# EAGLE design FAE_V2_1 (EAGLE 9.0.1)
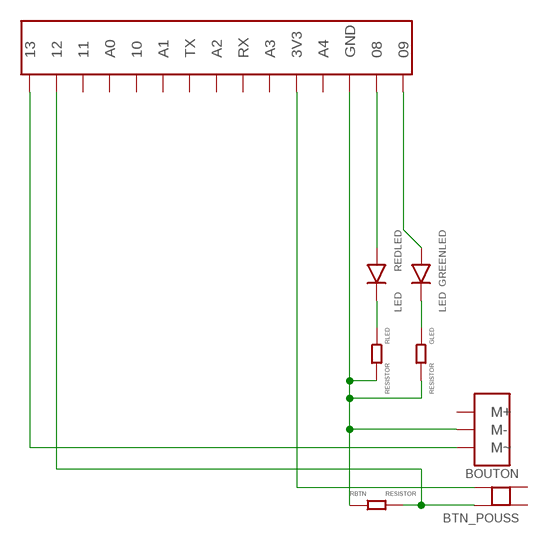
[diagram p0: schematic, sheet 1]

## Parts
BTN_POUSS  BOUTON  [BOUTON]
GLED  RESISTOR  [RESISTOR]
GREENLED  LED  [LED]
RBTN  RESISTOR  [RESISTOR]
REDLED  LED  [LED]
RLED  RESISTOR  [RESISTOR]
U$1  RAZOR_BOARD  [RAZOR_BOARD]
U$3  SERVO_ADAPT  [SERVO_ADAPT]

## Nets
N$1: GREENLED.IN U$1.09
N$2: GLED.A GREENLED.OUT
N$4: BTN_POUSS.D U$1.3V3
N$5: BTN_POUSS.C RBTN.B U$1.12
N$6: U$1.13 U$3.M~
N$10: GLED.B RBTN.A RLED.B U$1.GND U$3.M-
N$11: REDLED.IN U$1.08
N$12: REDLED.OUT RLED.A
Unconnected: BTN_POUSS.A BTN_POUSS.B U$1.10 U$1.11 U$1.A0 U$1.A1 U$1.A2 U$1.A3 U$1.A4 U$1.RX U$1.TX U$3.M+

## Library data of the parts
BTN_POUSS = FAE:BOUTON
GLED RBTN RLED = FAE:RESISTOR
GREENLED REDLED = FAE:LED
U$1 = FAE:RAZOR_BOARD
U$3 = FAE:SERVO_ADAPT

## Net classes
0 default: width 0.5 mm, drill 0.3 mm, clearance 0.7 mm

## Board
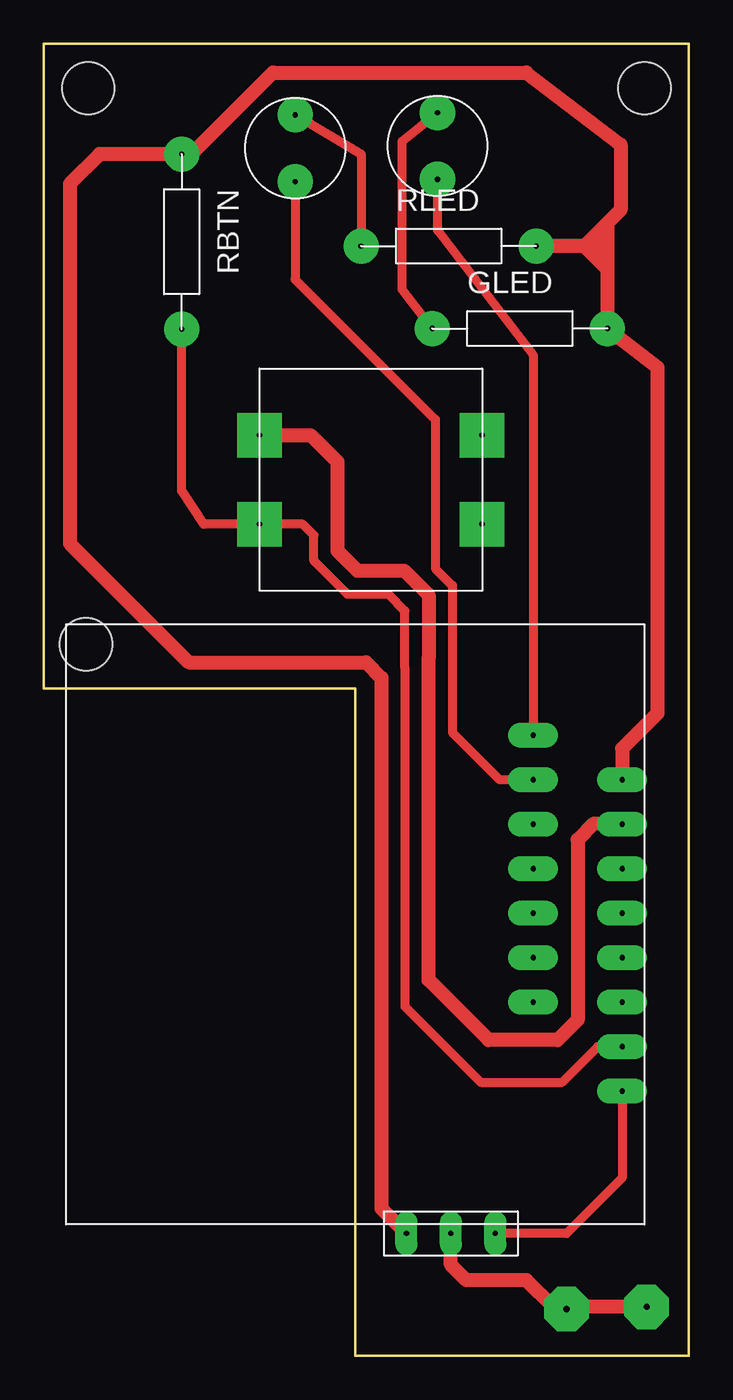
[diagram p1: board, top side]

Size 36.83 x 74.93 mm. Coordinates in mm from the lower left corner, seen from the top.
Outline: 36.83,0 36.83,74.93 0,74.93 0,38.1 17.78,38.1 17.78,0 36.83,0
Copper layers (1*16): Top 0.035mm / dielectric 1.5mm / Bottom 0.035mm
Design rules "default": minimum track width 6mil, minimum drill 0.35mm, track to track 6mil, track to pad 6mil, pad to pad 6mil, via to via 6mil, smd to smd 6mil, copper to edge 40mil, drill to drill 6mil, minimum pad ring 10mil, minimum via ring 8mil, stop-mask expansion 4mil, vias tented up to drill 0mil, thermal gap 10mil
Holes 3 mm at 34.29,72.39 2.54,72.39 2.41,40.64

### Footprints (pad centres in the part's own frame; a part is rotated, then mirrored left to right if it is on the bottom)
BOUTON = drill 0.3 pad 2.54 square: A -6.35,2.54; B -6.35,-2.54; C 6.35,2.54; D 6.35,-2.54
RESISTOR = drill 0.3 pad 2: A -5,0; B 5,0
LED = drill 0.3 pad 2: IN -1.905,0; OUT 1.905,0
RAZOR_BOARD = drill 0.3 pad 1.422 long: 3V3 -2.54,-5.08; 08 2.54,-7.62; 09 2.54,-10.16; 10 -2.54,2.54; 11 -2.54,5.08; 12 -2.54,7.62; 13 -2.54,10.16; A0 2.54,5.08; A1 2.54,2.54; A2 2.54,0; A3 2.54,-2.54; A4 2.54,-5.08; GND -2.54,-7.62; RX -2.54,-2.54; TX -2.54,0
SERVO_ADAPT = drill 0.3 pad 1.27 long: M+ 0,0; M- 0,2.54; M~ 0,-2.54

### Placement (x,y rotation side)
BTN_POUSS  18.67,50.04 180 top
GLED  27.18,58.67 0 top
GREENLED  22.48,69.09 90 top
RBTN  7.87,63.63 270 top
REDLED  14.35,68.96 90 top
RLED  23.11,63.37 0 top
U$1  30.48,25.27 180 top
U$3  23.24,6.99 90 top

### Tracks (layer width: path | path; a pad name or v marks a point on that pad's centre or on a via)
N$1
  Top 0.5: GREENLED.IN 22.48,64.26 27.94,57.15 U$1.09
N$2
  Top 0.5: GREENLED.OUT 20.45,69.34 20.45,60.91 GLED.A
N$3  (via drill 0.35 pad 2.54)
  other vias: 29.84,2.67
N$4
  Top 0.8: U$1.3V3 31.4,30.39 30.48,29.46 30.48,19.18 29.34,18.03 25.4,18.03 21.97,21.46 21.97,39.84 21.97,43.43 20.57,44.83 17.91,44.83 16.76,45.97 16.76,51.05 15.24,52.58 BTN_POUSS.D
N$5
  Top 0.5: U$1.12 31.62,17.65 29.59,15.62 24.94,15.62 20.62,19.94 20.62,39.28 20.62,42.55 19.68,43.48 17.35,43.48 15.41,45.41 15.41,46.86 14.78,47.5 BTN_POUSS.C 9.14,47.5 7.87,49.4 RBTN.B
N$6
  Top 0.5: U$1.13 33.02,10.16 29.84,6.99 U$3.M~
N$7  (via drill 0.35 pad 2.54)
  Top 0.8: v34.42,2.79 29.08,2.79 27.56,4.32 24.13,4.32 23.24,5.21 23.24,6.86
N$10
  Top 0.8: U$1.GND 33.02,34.67 35.05,36.7 35.05,56.44 GLED.B 32.18,62.06 | 30.86,63.37 RLED.B | 32.18,64.69 31.5,64.01 | 31.5,64.01 30.86,63.37 | 32.18,64.69 32.94,65.45 32.94,69.17 27.56,73.28 13.08,73.28 8.43,68.63 RBTN.A 3.19,68.63 1.49,66.93 1.49,46.39 8.29,39.59 18.4,39.59 19.27,38.72 19.27,8.41 U$3.M- | 32.18,64.69 32.18,62.06 | 30.86,63.37 31.5,62.74 | 31.5,62.74 32.18,62.06 | 31.5,64.01 31.5,62.74
N$11
  Top 0.5: U$1.08 26.04,32.89 23.32,35.61 23.32,43.99 22.35,44.96 22.35,53.47 14.35,61.47 REDLED.IN
N$12
  Top 0.5: REDLED.OUT 18.11,68.63 RLED.A

### Text on the board
Reference: 220Ω | BAT | ~ | - | +